# EAGLE schematic IIITDuino Ver0.2 (EAGLE 7.3.0)
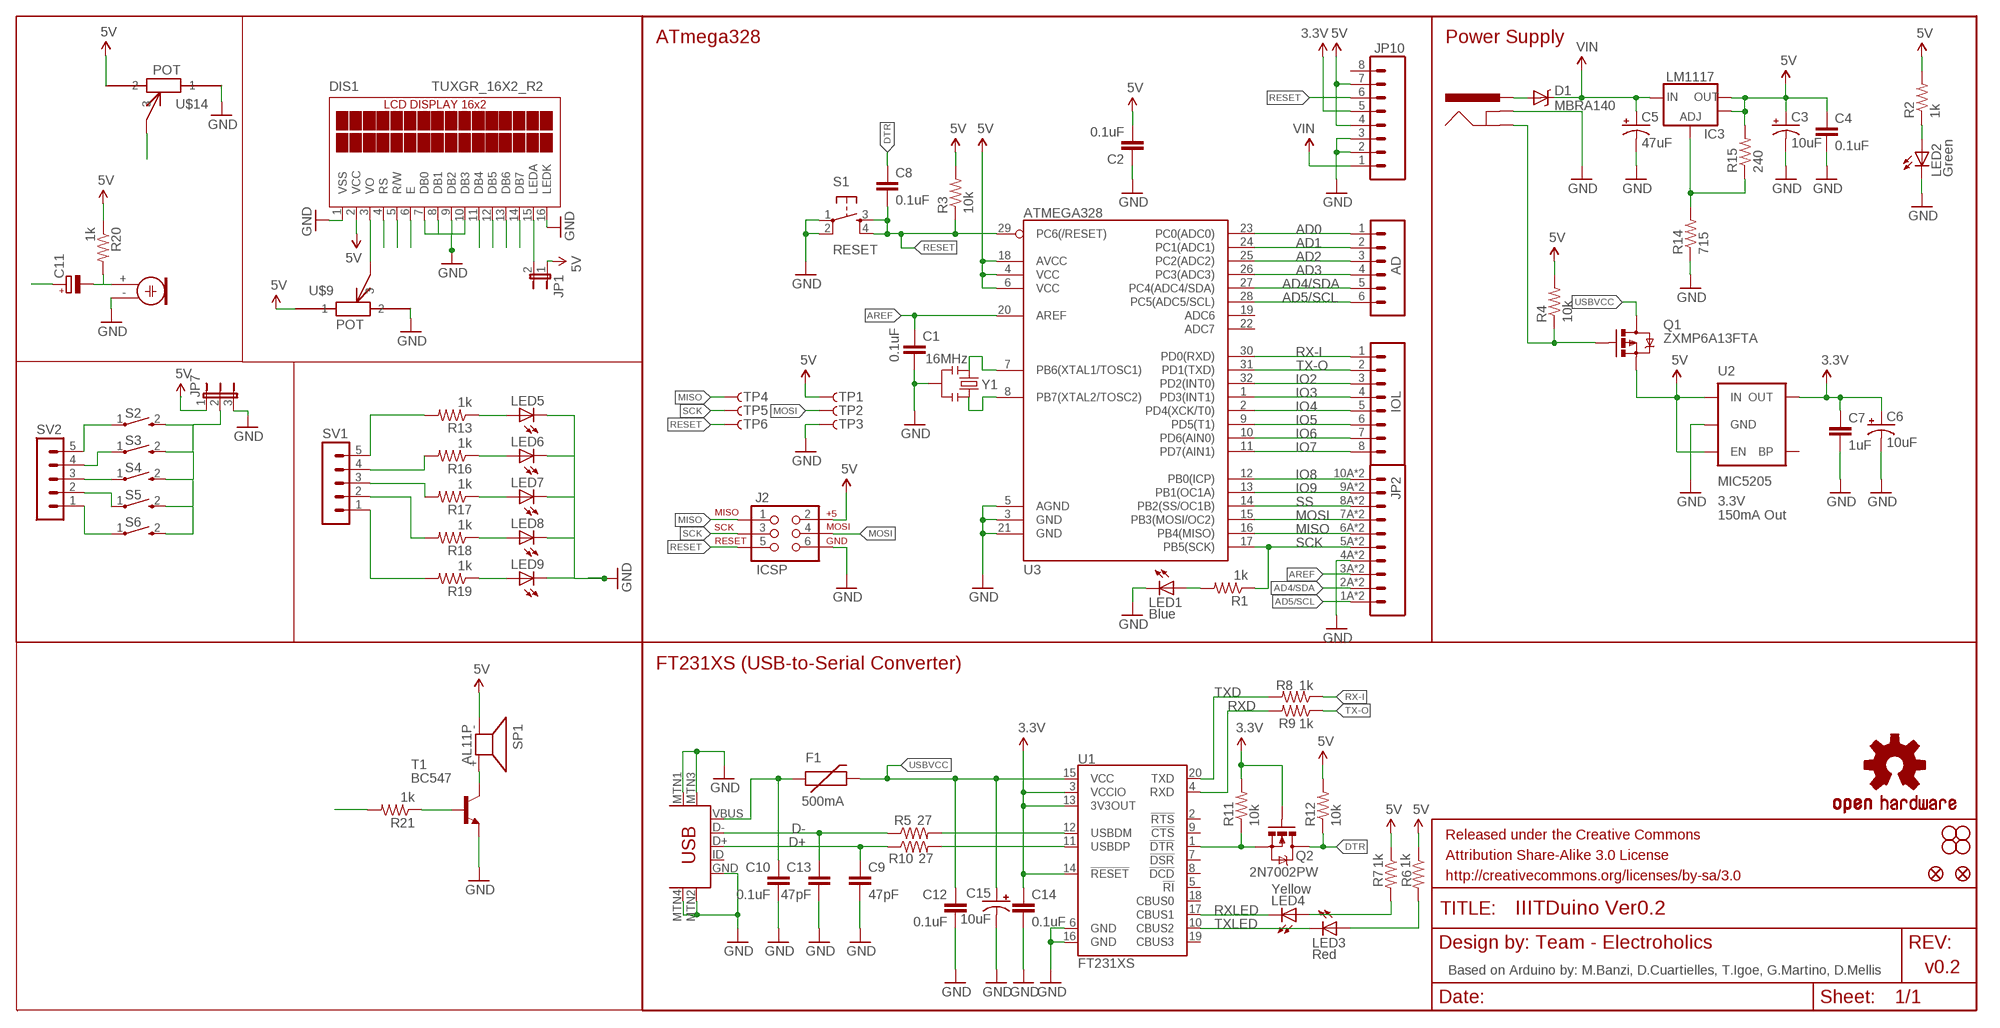
[diagram p0: schematic, sheet 1]

## Parts
AD  M06SMD-STRAIGHT-COMBO  [1X06_SMD_STRAIGHT_COMBO]
C1  0.1uF  CAP0603-CAP  [0603-CAP]
C2  0.1uF  CAP0603-CAP  [0603-CAP]
C3  10uF  CAP_POL1206  [EIA3216]
C4  0.1uF  CAP0603-CAP  [0603-CAP]
C5  47uF  CAP_POLD  [PANASONIC_D]
C6  10uF  CAP_POL1206  [EIA3216]
C7  1uF  CAP0603-CAP  [0603-CAP]
C8  0.1uF  CAP0603-CAP  [0603-CAP]
C9  47pF  47PF-50V-5%(0603)  [0603-CAP]
C10  0.1uF  CAP0603-CAP  [0603-CAP]
C11  CPOL-EUE2.5-5  [E2,5-5]
C12  0.1uF  CAP0603-CAP  [0603-CAP]
C13  47pF  47PF-50V-5%(0603)  [0603-CAP]
C14  0.1uF  CAP0603-CAP  [0603-CAP]
C15  10uF  CAP_POL1206  [EIA3216]
D1  MBRA140  DIODE-SCHOTTKY_  [SMA-DIODE]
DIS1  TUXGR_16X2_R2  [LCD_16X2_PAC]
F1  500mA  PTCSMD  [PTC-1206]
FRAME2  FRAME-LETTER  [CREATIVE_COMMONS]
IC3  LM1117  V_REG_LM1117ALT1  [SOT223-ALT1]
IOL  M08SMD-COMBO  [1X08_SMD_COMBINED]
J1  POWER_JACKOVERPASTE_REDBOARD_0603  [POWER_JACK_SMD_OVERPASTE_REDBOARD_0603]
J2  ICSP  AVR_SPI_PRG_6SMT_MALE  [2X3_SMT_POSTS]
JP1  JP1E  [JP1]
JP2  M10SMD_COMBO  [1X10_SMD_COMBINED]
JP3  STAND-OFF  [STAND-OFF]
JP4  STAND-OFF  [STAND-OFF]
JP5  STAND-OFF  [STAND-OFF]
JP6  STAND-OFF  [STAND-OFF]
JP7  JP2E  [JP2]
JP8  FIDUCIAL1X2  [FIDUCIAL-1X2]
JP9  FIDUCIAL1X2  [FIDUCIAL-1X2]
JP10  M08SMD-COMBO  [1X08_SMD_COMBINED]
LED1  Blue  LED1206-NS  [LED-1206-NO_SILK]
LED2  Green  LED1206-NS  [LED-1206-NO_SILK]
LED3  Red  LED1206-NS  [LED-1206-NO_SILK]
LED4  Yellow  LED1206-NS  [LED-1206-NO_SILK]
LED5  LEDCHIP-LED0805  [CHIP-LED0805]
LED6  LEDCHIP-LED0805  [CHIP-LED0805]
LED7  LEDCHIP-LED0805  [CHIP-LED0805]
LED8  LEDCHIP-LED0805  [CHIP-LED0805]
LED9  LEDCHIP-LED0805  [CHIP-LED0805]
M1  ELECTRET_MICROPHON-TOM-1545P-R  [TOM-1545P-R]
Q1  ZXMP6A13FTA  MOSFET-PCHANNELSMD  [SOT23-3]
Q2  2N7002PW  MOSFET-NCHANNEL2N7002PW  [SOT323]
R1  1k  RESISTOR0603-RES  [0603-RES]
R2  1k  RESISTOR0603-RES  [0603-RES]
R3  10k  RESISTOR0603-RES  [0603-RES]
R4  10k  RESISTOR0603-RES  [0603-RES]
R5  27  RESISTOR0603-RES  [0603-RES]
R6  1k  RESISTOR0603-RES  [0603-RES]
R7  1k  RESISTOR0603-RES  [0603-RES]
R8  1k  RESISTOR0603-RES  [0603-RES]
R9  1k  RESISTOR0603-RES  [0603-RES]
R10  27  RESISTOR0603-RES  [0603-RES]
R11  10k  RESISTOR0603-RES  [0603-RES]
R12  10k  RESISTOR0603-RES  [0603-RES]
R13  1k  RESISTOR0603-RES  [0603-RES]
R14  715  RESISTOR0603-RES  [0603-RES]
R15  240  RESISTOR0603-RES  [0603-RES]
R16  1k  RESISTOR0603-RES  [0603-RES]
R17  1k  RESISTOR0603-RES  [0603-RES]
R18  1k  RESISTOR0603-RES  [0603-RES]
R19  1k  RESISTOR0603-RES  [0603-RES]
R20  1k  RESISTOR0603-RES  [0603-RES]
R21  1k  RESISTOR0603-RES  [0603-RES]
S1  RESET  TAC_SWITCHSMD  [TACTILE_SWITCH_SMD]
S2  10-XX  [B3F-10XX]
S3  10-XX  [B3F-10XX]
S4  10-XX  [B3F-10XX]
S5  10-XX  [B3F-10XX]
S6  10-XX  [B3F-10XX]
SP1  AL11P  [AL11P]
SV1  MA05-1  [MA05-1]
SV2  MA05-1  [MA05-1]
T1  BC547  [TO92]
TP1  TP-3x5  TEST-POINT3X5  [PAD.03X.05]
TP2  TP-3x5  TEST-POINT3X5  [PAD.03X.05]
TP3  TP-3x5  TEST-POINT3X5  [PAD.03X.05]
TP4  TP-3x5  TEST-POINT3X5  [PAD.03X.05]
TP5  TP-3x5  TEST-POINT3X5  [PAD.03X.05]
TP6  TP-3x5  TEST-POINT3X5  [PAD.03X.05]
U1  FT231XS  [SSOP20_L]
U2  MIC5205  V_REG_LDOSMD  [SOT23-5]
U3  ATMEGA328  ATMEGA168  [TQFP32-08]
U$9  POT  [CA9V]
U$13  USB-MINIB-5PIN  [USB-MINIB]
U$14  POT  [CA9V]
U$16  OSHW-LOGOS  [OSHW-LOGO-S]
Y1  16MHz  RESONATORSMD  [RESONATOR-SMD]

## Nets
3.3V: C6.A(+) C7.1 C14.1 JP10.5 Q2.1(G) R11.2 U1.3(VCCIO) U1.13(3V3OUT) U1.14(!RESET) U2.5(OUT)
5V: C2.2 C3.A(+) C4.1 DIS1.2(VCC) IC3.2(OUT) IC3.4(OUT) J2.2 JP1.1 JP10.4 JP10.7 Q1.2(S) R2.2 R3.2 R4.2 R6.1 R7.1 R12.2 R15.2 R20.1 SP1.- TP1.P$1 U2.1(IN) U2.3(EN) U3.4(VCC) U3.6(VCC) U3.18(AVCC) U$9.A U$14.K
AD0: AD.1 U3.23(PC0(ADC0))
AD1: AD.2 U3.24(PC1(ADC1))
AD2: AD.3 U3.25(PC2(ADC2))
AD3: AD.4 U3.26(PC3(ADC3))
AD4/SDA: AD.5 JP2.2A JP2.2B U3.27(PC4(ADC4/SDA))
AD5/SCL: AD.6 JP2.1A JP2.1B U3.28(PC5(ADC5/SCL))
AREF: C1.1 JP2.3A JP2.3B U3.20(AREF)
D+: C9.1 R10.1 U$13.D+
D-: C13.1 R5.1 U$13.D-
DTR: C8.1 Q2.3(D) R12.1
GND: C1.2 C2.1 C3.C(-) C4.2 C5.- C6.C(-) C7.2 C9.2 C10.2 C12.2 C13.2 C14.2 C15.C(-) DIS1.1(VSS) DIS1.7(DB0) DIS1.8(DB1) DIS1.9(DB2) DIS1.10(DB3) DIS1.16(LEDK) J1.GND(GNDBREAK) J2.6 JP2.4A JP2.4B JP10.2 JP10.3 LED1.C LED2.C LED5.C LED6.C LED7.C LED8.C LED9.C M1.- R14.1 S1.1 S1.2 T1.1(E) TP3.P$1 U1.6(GND) U1.16(GND) U2.2(GND) U3.3(GND) U3.5(AGND) U3.21(GND) U$9.K U$13.GND U$13.MTN1(MTN2) U$13.MTN2(MTN3) U$13.MTN3(MTN1) U$13.MTN4 U$14.A Y1.2
INSERT: J1.P$4(GND) Q1.1(G) R4.1
IO2: IOL.3 U3.32(PD2(INT0))
IO3: IOL.4 U3.1(PD3(INT1))
IO4: IOL.5 U3.2(PD4(XCK/T0))
IO5: IOL.6 U3.9(PD5(T1))
IO6: IOL.7 U3.10(PD6(AIN0))
IO7: IOL.8 U3.11(PD7(AIN1))
IO8: JP2.10A JP2.10B U3.12(PB0(ICP))
IO9: JP2.9A JP2.9B U3.13(PB1(OC1A))
MISO: J2.1 JP2.6A JP2.6B TP4.P$1 U3.16(PB4(MISO))
MOSI: J2.4 JP2.7A JP2.7B TP2.P$1 U3.15(PB3(MOSI/OC2))
N$1: LED1.A R1.2
N$2: LED2.A R2.1
N$3: U3.7(PB6(XTAL1/TOSC1)) Y1.1
N$4: U3.8(PB7(XTAL2/TOSC2)) Y1.3
N$5: DIS1.3(VO) U$9.S
N$6: R5.2 U1.12(USBDM)
N$7: R10.2 U1.11(USBDP)
N$8: LED3.A R6.2
N$9: DIS1.4(RS)
N$10: LED4.A R7.2
N$11: DIS1.5(R/W)
N$12: Q2.2(S) R11.1 U1.1(!DTR)
N$13: DIS1.6(E)
N$14: DIS1.11(DB4)
N$15: IC3.1(ADJ) R14.2 R15.1
N$16: DIS1.12(DB5)
N$17: DIS1.13(DB6)
N$18: DIS1.14(DB7)
N$19: DIS1.15(LEDA) JP1.2
N$20: S2.1(P) SV2.5
N$21: LED5.A R13.1
N$22: LED6.A R16.1
N$23: LED7.A R17.1
N$24: LED8.A R18.1
N$25: LED9.A R19.1
N$26: R13.2 SV1.5
N$27: R16.2 SV1.4
N$28: R17.2 SV1.3
N$29: R18.2 SV1.2
N$30: R19.2 SV1.1
N$31: U$14.S
N$32: S3.1(P) SV2.4
N$33: S4.1(P) SV2.3
N$34: S5.1(P) SV2.2
N$35: S6.1(P) SV2.1
N$36: JP7.2 S2.2(S) S3.2(S) S4.2(S) S5.2(S) S6.2(S)
N$37: JP7.1
N$38: JP7.3
N$39: SP1.+ T1.3(C)
N$40: C11.+
N$41: C11.- M1.+ R20.2
N$42: R21.1 T1.2(B)
N$43: R21.2
PWRIN: D1.A J1.VIN0(PWR)
RESET: C8.2 J2.5 JP10.6 R3.1 S1.3 S1.4 TP6.P$1 U3.29(PC6(/RESET))
RX-I: IOL.1 R8.1 U3.30(PD0(RXD))
RXD: R9.2 U1.4(RXD)
RXLED: LED4.C U1.17(CBUS1)
SCK: J2.3 JP2.5A JP2.5B R1.1 TP5.P$1 U3.17(PB5(SCK))
SS: JP2.8A JP2.8B U3.14(PB2(SS/OC1B))
TX-O: IOL.2 R9.1 U3.31(PD1(TXD))
TXD: R8.2 U1.20(TXD)
TXLED: LED3.C U1.10(CBUS2)
USBVCC: C12.1 C15.A(+) F1.2 Q1.3(D) U1.15(VCC)
VIN: C5.+ D1.C IC3.3(IN) JP10.1
VUSB: C10.1 F1.1 U$13.VBUS
Unconnected: JP10.8 U1.2(!RTS) U1.5(!RI) U1.7(!DSR) U1.8(!DCD) U1.9(!CTS) U1.18(CBUS0) U1.19(CBUS3) U2.4(BP) U3.19(ADC6) U3.22(ADC7) U$13.ID

## Notes on the sheet
- ATmega328 | Power Supply
- 3.3V
  150mA Out
- FT231XS (USB-to-Serial Converter)
- Team - Electroholics
- Based on Arduino by: M.Banzi, D.Cuartielles, T.Igoe, G.Martino, D.Mellis | v0.2

## Library data of the parts
AD = SparkFun:M06: Header 6 Standard 6-pin 0.1" header. Use with straight break away headers (SKU : PRT-00116), right angle break away headers (PRT-00553), swiss pins (PRT-00743), machine pins (PRT-00117), and female headers (PRT-00115). Molex polarized connector foot print use with SKU : PRT-08094 with associated crimp pins and housings. NOTES ON THE VARIANTS LOCK and LOCK_LONGPADS... This footprint was designed to help hold the alignment of a through-hole component (i.e. 6-pin header) while soldering it into place. You may notice that each hole has been shifted either up or down by 0.005 of an inch from it's more standard position (which is a perfectly straight line). This slight alteration caused the pins (the squares in the middle) to touch the edges of the holes. Because they are alternating, it causes a "brace" to hold the component in place. 0.005 has proven to be the perfect amount of "off-center" position when using our standard breakaway headers. Although looks a little odd when you look at the bare footprint, once you have a header in there, the alteration is very hard to notice. Also, if you push a header all the way into place, it is covered up entirely on the bottom side. This idea of altering the position of holes to aid alignment will be further integrated into the Sparkfun Library for other footprints. It can help hold any component with 3 or more connection pins.
C1 C2 C4 C7 C8 C10 C12 C14 = SparkFun:CAP: Capacitor Standard 0603 ceramic capacitor, and 0.1" leaded capacitor.
C3 C5 C6 = SparkFun:CAP_POL: Capacitor Polarized These are standard SMD and PTH capacitors. Normally 10uF, 47uF, and 100uF in electrolytic and tantalum varieties. Always verify the external diameter of the through hole cap, it varies with capacity, voltage, and manufacturer. The EIA devices should be standard.
C9 C13 = SparkFun-Capacitors:47PF-50V-5%(0603): CAP-08913; PROD_ID: CAP-08913
C11 = rcl:CPOL-EU: POLARIZED CAPACITOR, European symbol
C15 = SparkFun-Capacitors:CAP_POL: Capacitor Polarized These are standard SMD and PTH capacitors. Normally 10uF, 47uF, and 100uF in electrolytic and tantalum varieties. Always verify the external diameter of the through hole cap, it varies with capacity, voltage, and manufacturer. The EIA devices should be standard.
D1 = SparkFun:DIODE-SCHOTTKY
DIS1 = lcd_16X2:TUXGR_16X2_R2: Tuxgraphics LCD display 16x2 characters reflective, without background light Source: tuxgr_12x2_r2.pdf
F1 = SparkFun:PTC: Resettable Fuse PTC Resettable Fuse. Spark Fun Electronics SKU : COM-08357
FRAME2 = SparkFun-Aesthetics:FRAME-LETTER: Schematic Frame Standard 8.5x11 US Letter frame
IC3 = Testing:V_REG_LM1117: Voltage Regulator LM1117 Standard adjustable voltage regulator but in SMD form. Spark Fun Electronics SKU : COM-00595
IOL = SparkFun:M08: Header 8 Standard 8-pin 0.1" header. Use with straight break away headers (SKU : PRT-00116), right angle break away headers (PRT-00553), swiss pins (PRT-00743), machine pins (PRT-00117), and female headers (PRT-00115).
J1 = Testing:POWER_JACK: Power Jack This is the standard 5.5mm barrel jack for power. The PTH is the most common, proven, reliable, footprint. All others are experimental. The Slot footprint only works if the mill layer is transmitted to the PCB fab house so be warned. Spark Fun Electronics SKU : PRT-00119. Mating wall wart : TOL-00298 (and others)
J2 = SparkFun-Connectors:AVR_SPI_PRG_6: AVR ISP 6 Pin This is the reduced ISP connector for AVR programming. Common on Arduino. This footprint will take up less PCB space and can be used with a 10-pin to 6-pin adapter such as SKU: BOB-08508
JP1 = jumper:JP1E: JUMPER
JP2 = SparkFun-Connectors:M10: Header 10 Standard 10-pin 0.1" header. Use with straight break away headers (SKU : PRT-00116), right angle break away headers (PRT-00553), swiss pins (PRT-00743), machine pins (PRT-00117), and female headers (PRT-00115).
JP3-JP6 = SparkFun:STAND-OFF: Stand Off This is the mechanical footprint for a #4 phillips button head screw. Use the keepout ring to avoid running the screw head into surrounding components. SKU : PRT-00447
JP7 = jumper:JP2E: JUMPER
JP8 JP9 = SparkFun:FIDUCIAL: Fiducial Alignment Points Various fiducial points for machine vision alignment.
JP10 = SparkFun-Connectors:M08: Header 8 Standard 8-pin 0.1" header. Use with straight break away headers (SKU : PRT-00116), right angle break away headers (PRT-00553), swiss pins (PRT-00743), machine pins (PRT-00117), and female headers (PRT-00115).
LED1-LED4 = SparkFun-LED:LED: LEDs Standard schematic elements and footprints for 5mm, 3mm, 1206, and 0603 sized LEDs. 5mm - Spark Fun Electronics SKU : COM-00529 (and others)
LED5-LED9 = led:LED: LED OSRAM: - CHIPLED LG R971, LG N971, LY N971, LG Q971, LY Q971, LO R971, LY R971 LH N974, LH R974 LS Q976, LO Q976, LY Q976 LO Q996 - Hyper CHIPLED LW Q18S LB Q993, LB Q99A, LB R99A - SideLED LS A670, LO A670, LY A670, LG A670, LP A670 LB A673, LV A673, LT A673, LW A673 LH A674 LY A675 LS A676, LA A676, LO A676, LY A676, LW A676 LS A679, LY A679, LG A679 - Hyper Micro SIDELED® LS Y876, LA Y876, LO Y876, LY Y876 LT Y87S - SmartLED LW L88C, LW L88S LB L89C, LB L89S, LG L890 LS L89K, LO L89K, LY L89K LS L896, LA L896, LO L896, LY L896 - TOPLED LS T670, LO T670, LY T670, LG T670, LP T670 LSG T670, LSP T670, LSY T670, LOP T670, LYG T670 LG T671, LOG T671, LSG T671 LB T673, LV T673, LT T673, LW T673 LH T674 LS T676, LA T676, LO T676, LY T676, LB T676, LH T676, LSB T676, LW T676 LB T67C, LV T67C, LT T67C, LS T67K, LO T67K, LY T67K, LW E67C LS E67B, LA E67B, LO E67B, LY E67B, LB E67C, LV E67C, LT E67C LW T67C LS T679, LY T679, LG T679 LS T770, LO T770, LY T770, LG T770, LP T770 LB T773, LV T773, LT T773, LW T773 LH T774 LS E675, LA E675, LY E675, LS T675 LS T776, LA T776, LO T776, LY T776, LB T776 LHGB T686 LT T68C, LB T68C - Hyper Mini TOPLED® LB M676 - Mini TOPLED Santana® LG M470 LS M47K, LO M47K, LY M47K Source: http://www.osram.convergy.de LUXEON: - LUMILED® LXK2-PW12-R00, LXK2-PW12-S00, LXK2-PW14-U00, LXK2-PW14-V00 LXK2-PM12-R00, LXK2-PM12-S00, LXK2-PM14-U00 LXK2-PE12-Q00, LXK2-PE12-R00, LXK2-PE12-S00, LXK2-PE14-T00, LXK2-PE14-U00 LXK2-PB12-K00, LXK2-PB12-L00, LXK2-PB12-M00, LXK2-PB14-N00, LXK2-PB14-P00, LXK2-PB14-Q00 LXK2-PR12-L00, LXK2-PR12-M00, LXK2-PR14-Q00, LXK2-PR14-R00 LXK2-PD12-Q00, LXK2-PD12-R00, LXK2-PD12-S00 LXK2-PH12-R00, LXK2-PH12-S00 LXK2-PL12-P00, LXK2-PL12-Q00, LXK2-PL12-R00 Source: www.luxeon.com KINGBRIGHT: KA-3528ASYC Source: www.kingbright.com
M1 = microphon:ELECTRET_MICROPHON-: Electret Condenser Microphone
Q1 = SparkFun:MOSFET-PCHANNEL
Q2 = SparkFun-DiscreteSemi:MOSFET-NCHANNEL: Common NMOSFET Parts MFG P/N Store ID Prod ID FDD8780 TRANS-09984 SI7820DN TRANS-11055 FDS6630A IC-08089 2N7002PW TRANS-11151 FQP30N06L COM-10213 TRANS-10060 BSS123LT1G TRANS-08345 BSS138 TRANS-00830 BS170 2N7000; PROD_ID: TRANS-11151
R1-R4 R6-R9 R11-R21 = SparkFun:RESISTOR: Resistor Basic schematic elements and footprints for 0603, 1206, and PTH resistors.
R5 R10 = SparkFun-Resistors:RESISTOR: Resistor Basic schematic elements and footprints for 0603, 1206, and PTH resistors.
S1 = SparkFun:TAC_SWITCH: Momentary Switch Button commonly used for reset or general input. Spark Fun Electronics SKU : COM-00097
S2-S6 = switch:10-XX: OMRON SWITCH
SP1 = buzzer:AL11P: SPEAKER Source: Buerklin; OC_FARNELL: unknown; OC_NEWARK: unknown
SV1 SV2 = con-lstb:MA05-1: PIN HEADER; OC_FARNELL: unknown; OC_NEWARK: unknown
T1 = transistor:BC547: NPN TRANSISTOR
TP1-TP6 = SparkFun-Passives:TEST-POINT: Bare copper test points for troubleshooting or ICT
U1 = SparkFun-DigitalIC:FT231X: FTDI FT231X Full Speed USB to Full-handshake UART This USB2.0 Full Speed IC offers a compact bridge to full handshake UART interfaces. The device is a UART, capable of operating up to 3MBaud, with low power consumption (8mA). The FT231X includes the complete FT-X series feature set and enables USB to be added into a system design quickly and easily over a UART interface.
U2 = SparkFun:V_REG_LDO: Voltage Regulator LDO Standard 150mA LDO voltage regulator in SOT-23 layout. Micrel part MIC5205. BP (by-pass) pin is used to lower output noise with 470pF cap.
U3 = SparkFun:ATMEGA168
U$9 U$14 = potentiometer:POT
U$13 = SparkFun-Connectors:USB-MINIB: Mini-USB "B" connector with 5th pin broken out. Created new symbol breaking out 5th "ID" pin in mini/micro USB connector spec. See: http://en.wikipedia.org/wiki/Mini_usb#Cables. Uses same footprint as 4-pin symbol. Also added pins to connect to mounting / shield pads if required (probably not generally needed as signals aren't shielded once they leave the connector).
U$16 = SparkFun-Aesthetics:OSHW-LOGO: Open Source Hardware Logo This logo indicates the piece of hardware it is found on incorporates a OSHW license and/or adheres to the definition of open source hardware found here: http://freedomdefined.org/OSHW
Y1 = SparkFun-FreqCtrl:RESONATOR: Resonator Small SMD resonator. This is the itty bitty 10/20MHz resonators with built in caps. CSTCE10M0G55 and CSTCE20M0V53. Footprint has been reviewed closely but hasn't been tested yet.

## Net classes
0 default: width 0.152 mm, drill 0.305 mm, clearance 0.152 mm